# EAGLE design NXT (EAGLE 6.3)
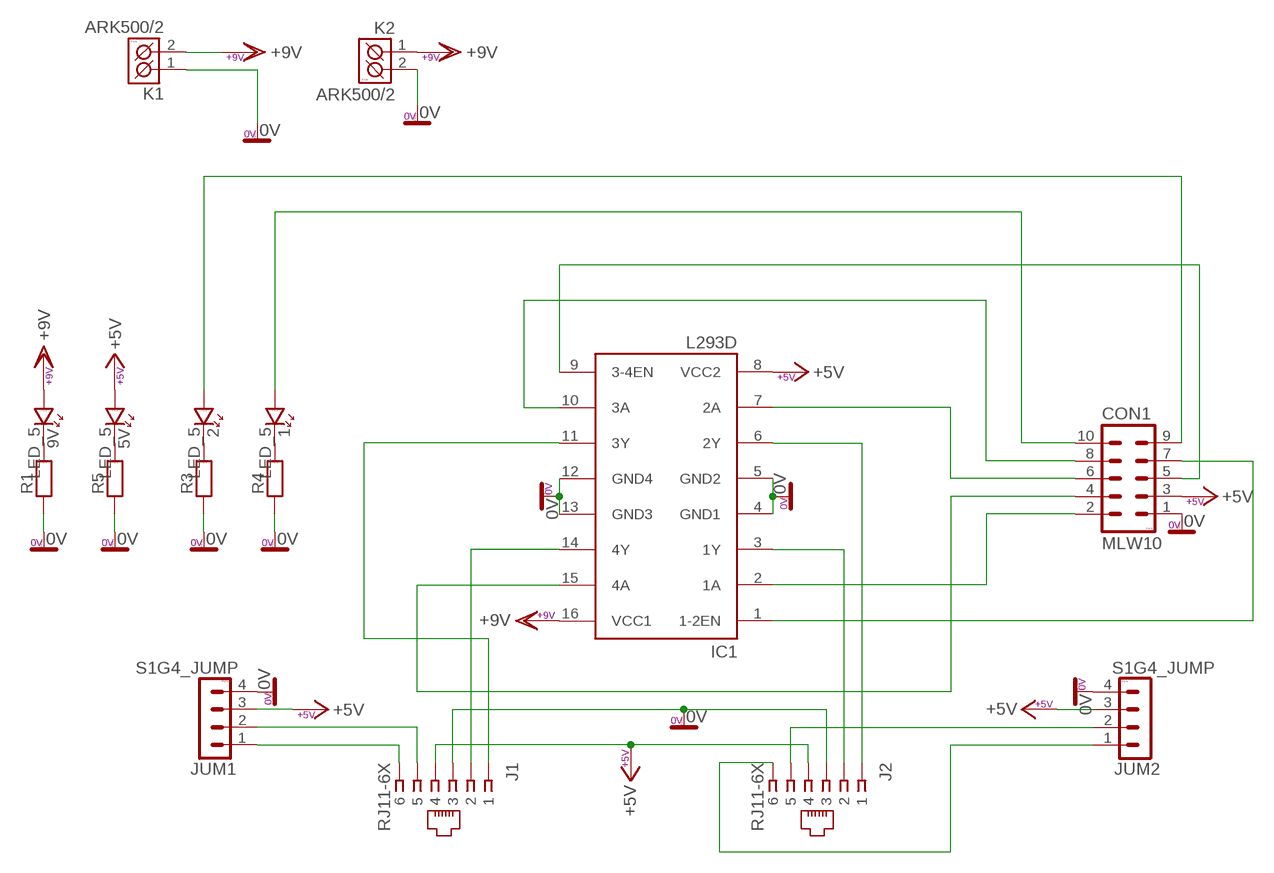
[diagram p0: schematic, sheet 1]

## Parts
1  LED_5  [LED_5]
2  LED_5  [LED_5]
5V  LED_5  [LED_5]
9V  LED_5  [LED_5]
CON1  MLW10  [MLW10G]
IC1  L293D  [DIL16]
J1  RJ11-6X  [RJ11-NO_SHIELD]
J2  RJ11-6X  [RJ11-NO_SHIELD]
JUM1  S1G4_JUMP  [S1G4_JUM]
JUM2  S1G4_JUMP  [S1G4_JUM]
K1  ARK500/2  [ARK500/2]
K2  ARK500/2  [ARK500/2]
R1  R_10  [R-10]
R3  R_10  [R-10]
R4  R_10  [R-10]
R5  R_10  [R-10]

## Nets
0V: CON1.1 IC1.4(GND1) IC1.5(GND2) IC1.12(GND4) IC1.13(GND3) J1.3 J2.3 JUM1.4 JUM2.4 K1.1(K1) K2.2(K2) R1.1 R3.1 R4.1 R5.1
+5V: 5V.A CON1.3 IC1.8(VCC2) J1.4 J2.4 JUM1.3 JUM2.3
+9V: 9V.A IC1.16(VCC1) K1.2(K2) K2.1(K1)
N$1: IC1.11(3Y) J1.1
N$2: IC1.14(4Y) J1.2
N$3: CON1.6 IC1.7(2A)
N$4: CON1.2 IC1.2(1A)
N$5: IC1.3(1Y) J2.2
N$6: IC1.6(2Y) J2.1
N$7: CON1.7 IC1.1(1-2EN)
N$8: CON1.5 IC1.9(3-4EN)
N$9: CON1.8 IC1.10(3A)
N$10: CON1.4 IC1.15(4A)
N$11: 1.A CON1.10
N$12: 2.A CON1.9
N$13: 9V.K R1.2
N$14: 5V.K R5.2
N$15: 2.K R3.2
N$16: 1.K R4.2
N$17: J2.5 JUM2.2
N$18: J2.6 JUM2.1
N$19: J1.5 JUM1.2
N$20: J1.6 JUM1.1

## Library data of the parts
1 2 5V 9V = #PaJa_30:LED: LED - jednobarevna
CON1 = #PaJa_konektory:MLW10: Konektory MLW - vidlice - 10x
IC1 = st-microelectronics:L293D: PUSH-PULL 4 CHANNEL DRIVER; MPN: L293D; OC_FARNELL: 9589619; OC_NEWARK: 56P8249
J1 J2 = con-tycoelectronics:RJ11: CORCOM Modular RJ Jacks No Shield Source: www.tycoelectronics.com .. ENG_DS_1654001_1099_RJ_L_0507.pdf; MPN: RJ11-6X; OC_FARNELL: unknown; OC_NEWARK: 16R6089
JUM1 JUM2 = #PaJa_konektory:S1G4_JUMP: Radove konektory - koliky - 4x
K1 K2 = #PaJa_konektory:ARK500/2: Svorkovnice - roztec 5mm - dvojita
R1 R3-R5 = #PaJa_30:R: Rezistor

## Board
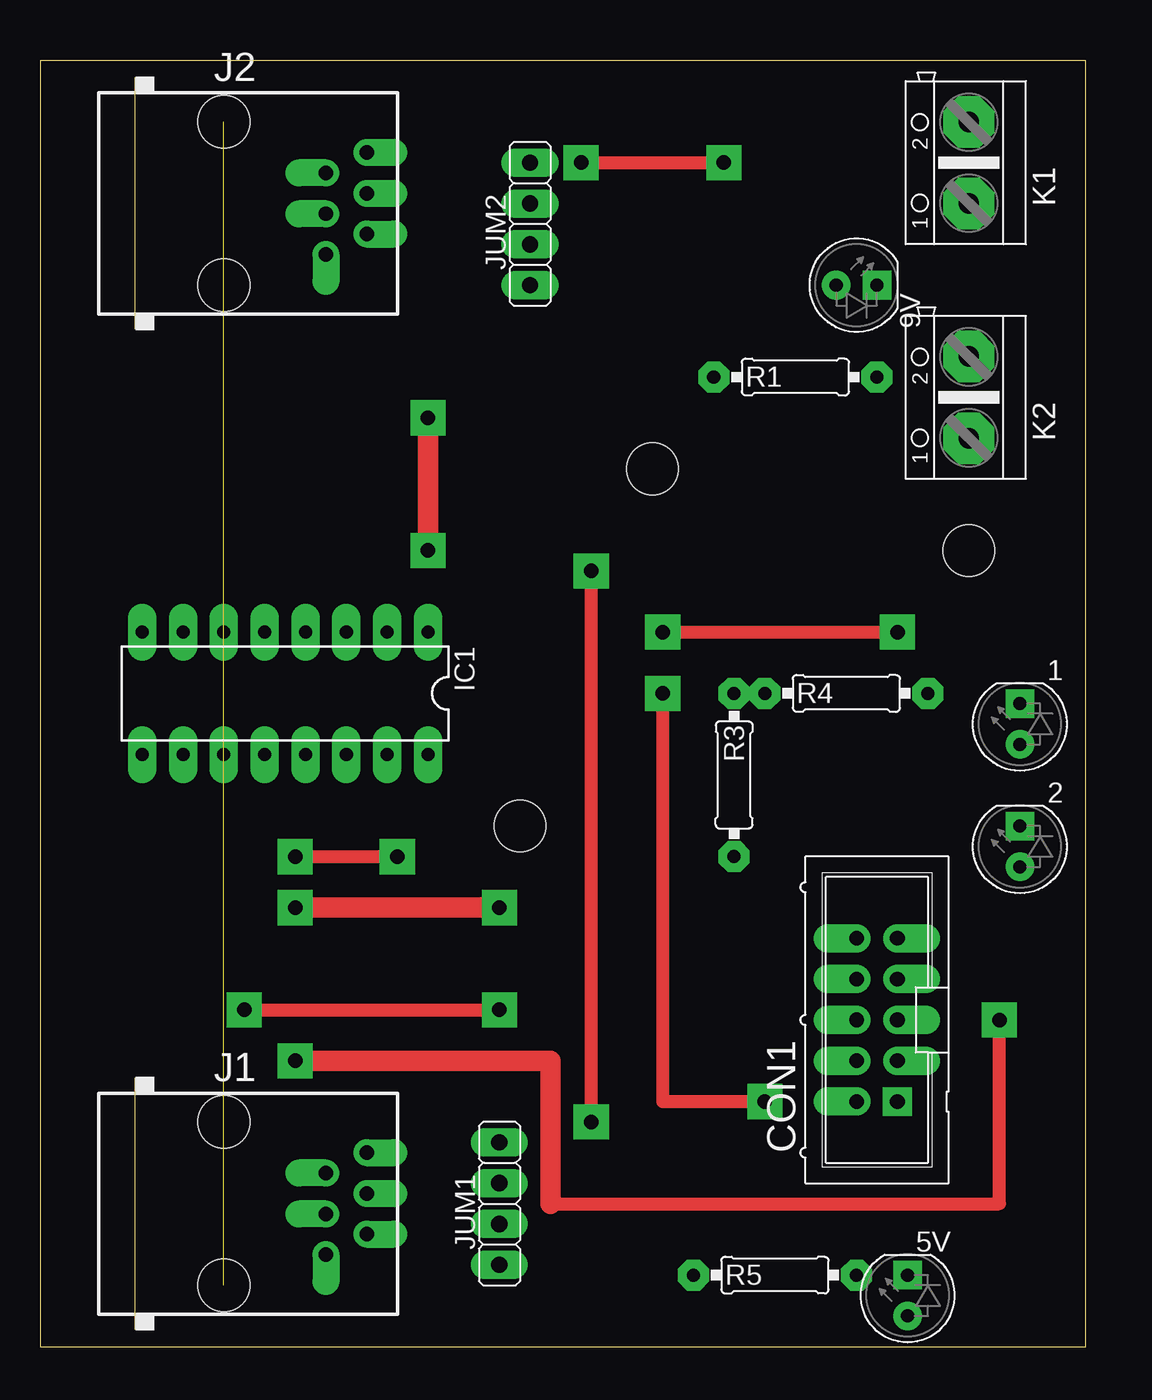
[diagram p1: board, top side]
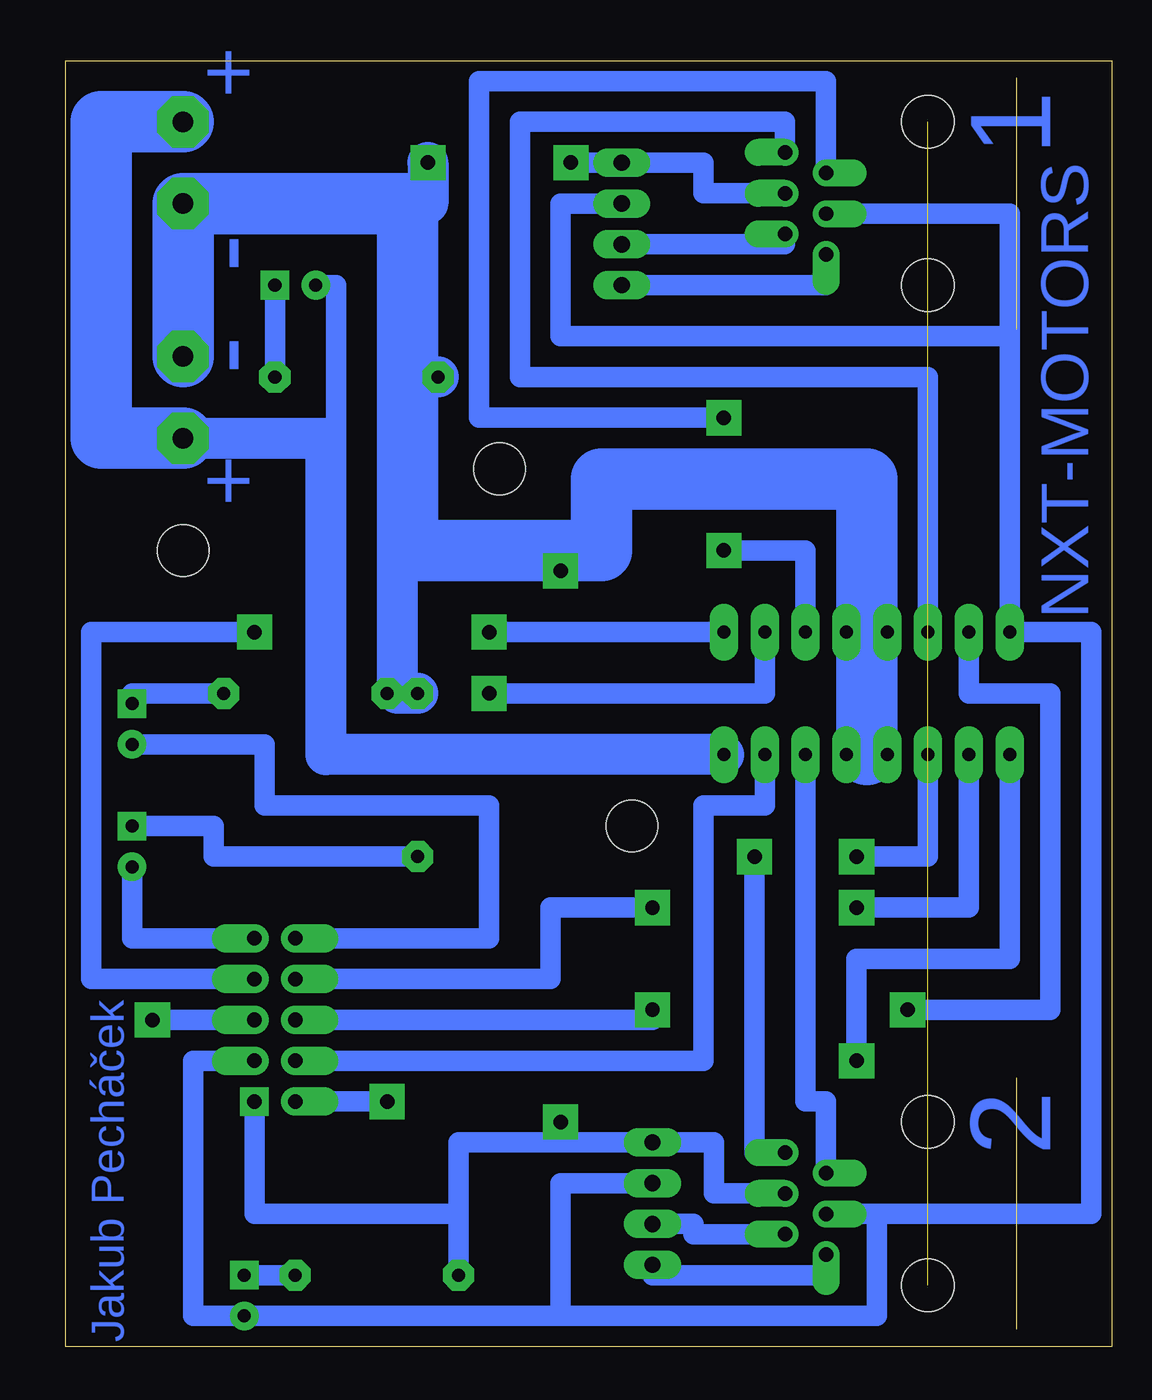
[diagram p2: board, bottom side, seen from below]

Size 65.08 x 80 mm. Coordinates in mm from the lower left corner, seen from the top.
Outline: 0,0 65.08,0 65.08,80 0,80 0,0
Copper layers (1*16): Top 0.035mm / dielectric 1.5mm / Bottom 0.035mm
Design rules "default": minimum track width 10mil, minimum drill 24mil, track to track 8mil, track to pad 8mil, pad to pad 8mil, via to via 8mil, smd to smd 8mil, copper to edge 40mil, drill to drill 8mil, minimum pad ring 10mil, minimum via ring 8mil, stop-mask expansion 4mil, vias tented up to drill 0mil, thermal gap 10mil
Holes 3.2 mm at 29.84,32.38 38.1,54.61 57.78,49.53

### Footprints (pad centres in the part's own frame; a part is rotated, then mirrored left to right if it is on the bottom)
LED_5 = drill 0.813 pad 1.778: A -1.27,0 | drill 0.813 pad 1.778 square: K 1.27,0
MLW10G = drill 0.914 pad 1.778 square: 1 -5.08,-1.27 | drill 0.914 pad 1.778 offset: 2 -5.08,1.27; 3 -2.54,-1.27; 4 -2.54,1.27; 5 0,-1.27; 6 0,1.27; 7 2.54,-1.27; 8 2.54,1.27; 9 5.08,-1.27; 10 5.08,1.27
DIL16 = drill 0.813 pad 1.778 long: 1 -8.89,-3.81; 2 -6.35,-3.81; 3 -3.81,-3.81; 4 -1.27,-3.81; 5 1.27,-3.81; 6 3.81,-3.81; 7 6.35,-3.81; 8 8.89,-3.81; 9 8.89,3.81; 10 6.35,3.81; 11 3.81,3.81; 12 1.27,3.81; 13 -1.27,3.81; 14 -3.81,3.81; 15 -6.35,3.81; 16 -8.89,3.81
RJ11-NO_SHIELD = drill 0.9 pad 1.676 offset: 1 -3.175,8.89; 2 -1.905,6.35; 3 -0.635,8.89; 4 0.635,6.35; 5 1.905,8.89; 6 3.175,6.35 | hole 3.251: -5.08,0; 5.08,0
S1G4_JUM = drill 1.016 pad 1.778 long: 1 -3.81,0; 2 -1.27,0; 3 1.27,0; 4 3.81,0
ARK500/2 = drill 1.27 pad 3.2 octagon: 1 -2.54,0; 2 2.54,0
R-10 = drill 0.813 pad 1.93 octagon: 1 -5.08,0; 2 5.08,0

### Placement (x,y rotation side)
1  60.96,38.73 90 top
2  60.96,31.11 90 top
5V  53.98,3.17 90 top
9V  50.8,66.04 0 top
CON1  52.07,20.32 90 top
IC1  15.24,40.64 180 top
J1  11.43,8.89 270 top
J2  11.43,71.12 270 top
JUM1  28.57,8.89 90 top
JUM2  30.48,69.85 90 top
K1  57.78,73.66 90 top
K2  57.78,59.05 90 top
R1  46.99,60.33 0 top
R3  43.18,35.56 270 top
R4  50.16,40.64 0 top
R5  45.72,4.45 0 top

### Tracks (layer width: path | path; a pad name or v marks a point on that pad's centre or on a via)
0V  (via drill 0.9 pad 2.18)
  Top 0.813: v33.66,73.66 v42.55,73.66 | v34.29,13.97 v34.29,48.26
  Bottom 0.813: IC1.12 15.24,36.83 | IC1.13 IC1.4 IC1.5
  Bottom 1.27: R5.1 40.64,8.26 | 40.64,8.26 53.34,8.26 CON1.1 | R4.1 44.45,40.64 | 40.64,8.26 40.64,12.7 34.29,12.7 | J2.3 25.4,71.75 25.4,73.66 JUM2.4 v33.66,73.66 | J1.3 24.77,9.53 24.77,12.7 JUM1.4 34.29,12.7 | 34.29,12.7 v34.29,13.97 | 36.2,49.53 v34.29,48.26 | IC1.13 15.24,36.83
  Bottom 2.54: v42.55,73.66 42.55,71.12 43.81,71.12 | R1.1 43.81,60.33 | R3.1 44.45,40.64 44.45,50.16 43.81,50.16 43.81,49.53
  Bottom 3.81: 15.24,36.83 15.24,53.98 31.75,53.98 31.75,49.53 36.2,49.53 43.81,49.53 43.81,60.33 43.81,71.12 K1.1 K2.2
+5V
  Bottom 0.406: JUM2.3 30.48,70.48
  Bottom 1.27: CON1.3 57.15,17.78 57.15,1.91 5V.A 34.29,1.91 | JUM1.3 34.29,10.16 34.29,1.91 | 6.35,62.87 IC1.8 1.27,44.45 1.27,8.26 14.61,8.26 | 6.35,62.87 6.35,70.48 J2.4 | JUM2.3 34.29,71.12 34.29,62.87 6.35,62.87 | 14.61,8.26 J1.4 | 14.61,8.26 14.61,1.91 34.29,1.91
+9V
  Bottom 1.27: 9V.A 48.26,66.04 48.26,56.52 48.9,56.52
  Bottom 2.54: IC1.16 48.9,36.83 48.9,56.52 K2.1
  Bottom 3.81: K1.2 62.87,76.2 62.87,56.52 K2.1
N$1  (via drill 0.9 pad 2.18)
  Top 0.813: v15.88,30.48 v22.23,30.48
  Bottom 0.813: 20.95,12.06 J1.1
  Bottom 1.27: v22.23,30.48 22.23,12.06 20.95,12.06 | v15.88,30.48 11.43,30.48 IC1.11
N$2
  Bottom 1.27: IC1.14 19.05,15.24 17.78,15.24 J1.2
N$3  (via drill 0.9 pad 2.18)
  Top 0.813: v12.7,20.95 v28.57,20.95
  Bottom 1.27: IC1.7 8.89,40.64 3.81,40.64 3.81,20.95 v12.7,20.95 | v28.57,20.95 28.57,20.32 CON1.6
N$4  (via drill 0.9 pad 2.18)
  Top 0.813: v38.73,40.64 38.73,15.24 v45.09,15.24
  Bottom 1.27: IC1.2 21.59,40.64 v38.73,40.64 | v45.09,15.24 CON1.2
N$5  (via drill 0.9 pad 2.18)
  Top 1.27: v24.13,57.78 v24.13,49.53
  Bottom 1.27: J2.2 17.78,78.74 39.37,78.74 39.37,57.78 v24.13,57.78 | IC1.3 19.05,49.53 v24.13,49.53
N$6
  Bottom 1.27: J2.1 20.32,76.2 36.83,76.2 36.83,60.33 11.43,60.33 IC1.6
N$7  (via drill 0.9 pad 2.18)
  Top 0.813: v38.73,44.45 v53.34,44.45
  Bottom 1.27: IC1.1 v38.73,44.45 | v53.34,44.45 63.5,44.45 63.5,22.86 CON1.7
N$8  (via drill 0.9 pad 2.18)
  Top 0.813: 31.75,8.89 59.69,8.89 v59.69,20.32
  Top 1.27: v15.88,17.78 31.75,17.78 31.75,8.89
  Bottom 1.27: v59.69,20.32 CON1.5 | IC1.9 6.35,24.13 15.88,24.13 v15.88,17.78
N$9  (via drill 0.9 pad 2.18)
  Top 1.27: v15.88,27.3 v28.57,27.3
  Bottom 1.27: v28.57,27.3 34.92,27.3 34.92,22.86 CON1.8 | IC1.10 8.89,27.3 v15.88,27.3
N$10
  Bottom 1.27: IC1.15 21.59,33.66 25.4,33.66 25.4,17.78 CON1.4
N$11
  Bottom 1.27: 1.A 52.7,37.47 52.7,33.66 38.73,33.66 38.73,25.4 CON1.10
N$12
  Bottom 1.27: 2.A 60.96,25.4 CON1.9
N$13
  Bottom 1.27: R1.2 9V.K
N$14
  Bottom 1.27: R5.2 5V.K
N$15
  Bottom 1.27: R3.2 55.88,30.48 55.88,32.38 2.K
N$16
  Bottom 1.27: R4.2 60.96,40.64 1.K
N$17
  Bottom 0.813: 20.32,68.58 J2.5
  Bottom 1.27: JUM2.2 20.32,68.58
N$18
  Bottom 1.27: J2.6 17.78,66.04 JUM2.1
N$19
  Bottom 1.27: J1.5 26.04,6.99 26.04,7.62 JUM1.2
N$20
  Bottom 1.27: J1.6 17.78,4.45 28.57,4.45 JUM1.1
N$23  (via drill 0.9 pad 3.1)  (3 unrouted)
  other vias: 11.43,76.2 11.43,66.04 11.43,13.97 11.43,3.81

### Text on the board
Bottom: 1 | + | NXT-MOTORS | - | - | + | Jakub Pecháček | 2